# Altium schematic sheet Block Diagram.SchDoc
size A3; ApprovedBy: Mustafa Atılay Beycan; CheckedBy: Mustafa Atılay Beycan; Author: Mustafa Atılay Beycan; CompanyName: Mustafa Atılay Beycan; DrawnBy: Mustafa Atılay Beycan; Engineer: Mustafa Atılay Beycan; Organization: Mustafa Atılay Beycan; SheetNumber: 1; SheetTotal: 8; FilePath: https://github.com/mustafaatilay/Outdoor-Tracking-Project
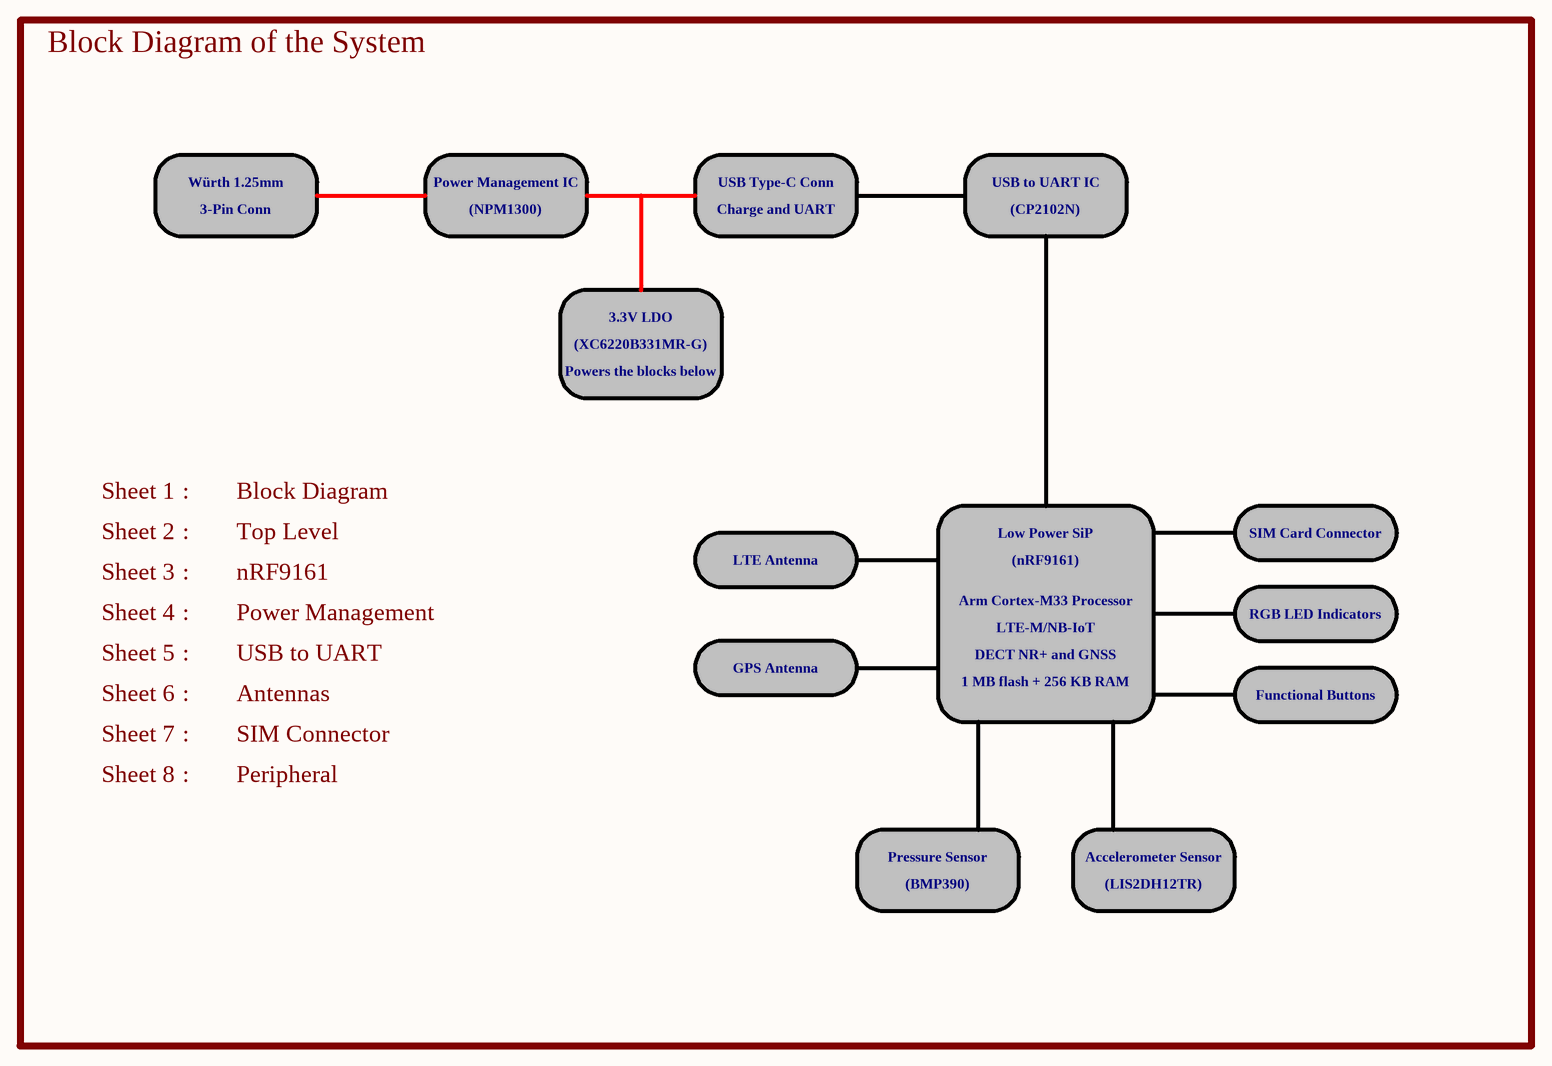
[diagram p0: Block Diagram.SchDoc]

## Notes on the sheet
- Block Diagram of the System
- Würth 1.25mm
- 3-Pin Conn
- Power Management IC
- (NPM1300)
- USB Type-C Conn
- Charge and UART
- USB to UART IC
- (CP2102N)
- 3.3V LDO
- (XC6220B331MR-G)
- Powers the blocks below
- Sheet 1
- Sheet 2
- :
- Block Diagram
- Top Level
- Low Power SiP
- SIM Card Connector
- Sheet 3
- nRF9161
- LTE Antenna
- (nRF9161)
- Arm Cortex-M33 Processor
- RGB LED Indicators
- Sheet 4
- Sheet 5
- Power Management
- USB to UART
- GPS Antenna
- LTE-M/NB-IoT
- DECT NR+ and GNSS
- 1 MB flash + 256 KB RAM
- Sheet 6
- Sheet 7
- Antennas
- SIM Connector
- Functional Buttons
- Sheet 8
- Peripheral
- Pressure Sensor
- (BMP390)
- Accelerometer Sensor
- (LIS2DH12TR)
- Project Name
- Designed by
- Schematic Name
- Checked by
- Page Size
- File Path
- Modified Date
- Revision No
- Sheet
- of
- A3